# Altium schematic sheet regbot_v3.SchDoc: Regbot v.3
size A3; DrawnBy: TTAN; Engineer: TTAN; Revision: 1.2; SheetNumber: 1; SheetTotal: 1; PageSetup: Record=PageOptions|CenterHorizontal=True|CenterVertical=True|PrintScale=1.04|XCorrection=1.00|YCorrection=1.00|PrintKind=1|BorderSize=5000000|LeftOffset=0|BottomOffset=0|Orientation=2|PaperLength=1000|PaperWidth=1000|Scale=100|PaperSource=15|PrintQuality=600|MediaType=1|DitherType=10|PrintScaleMode=1|PaperKind=A3|PaperIndex=8; ProjectName: Regbot v3
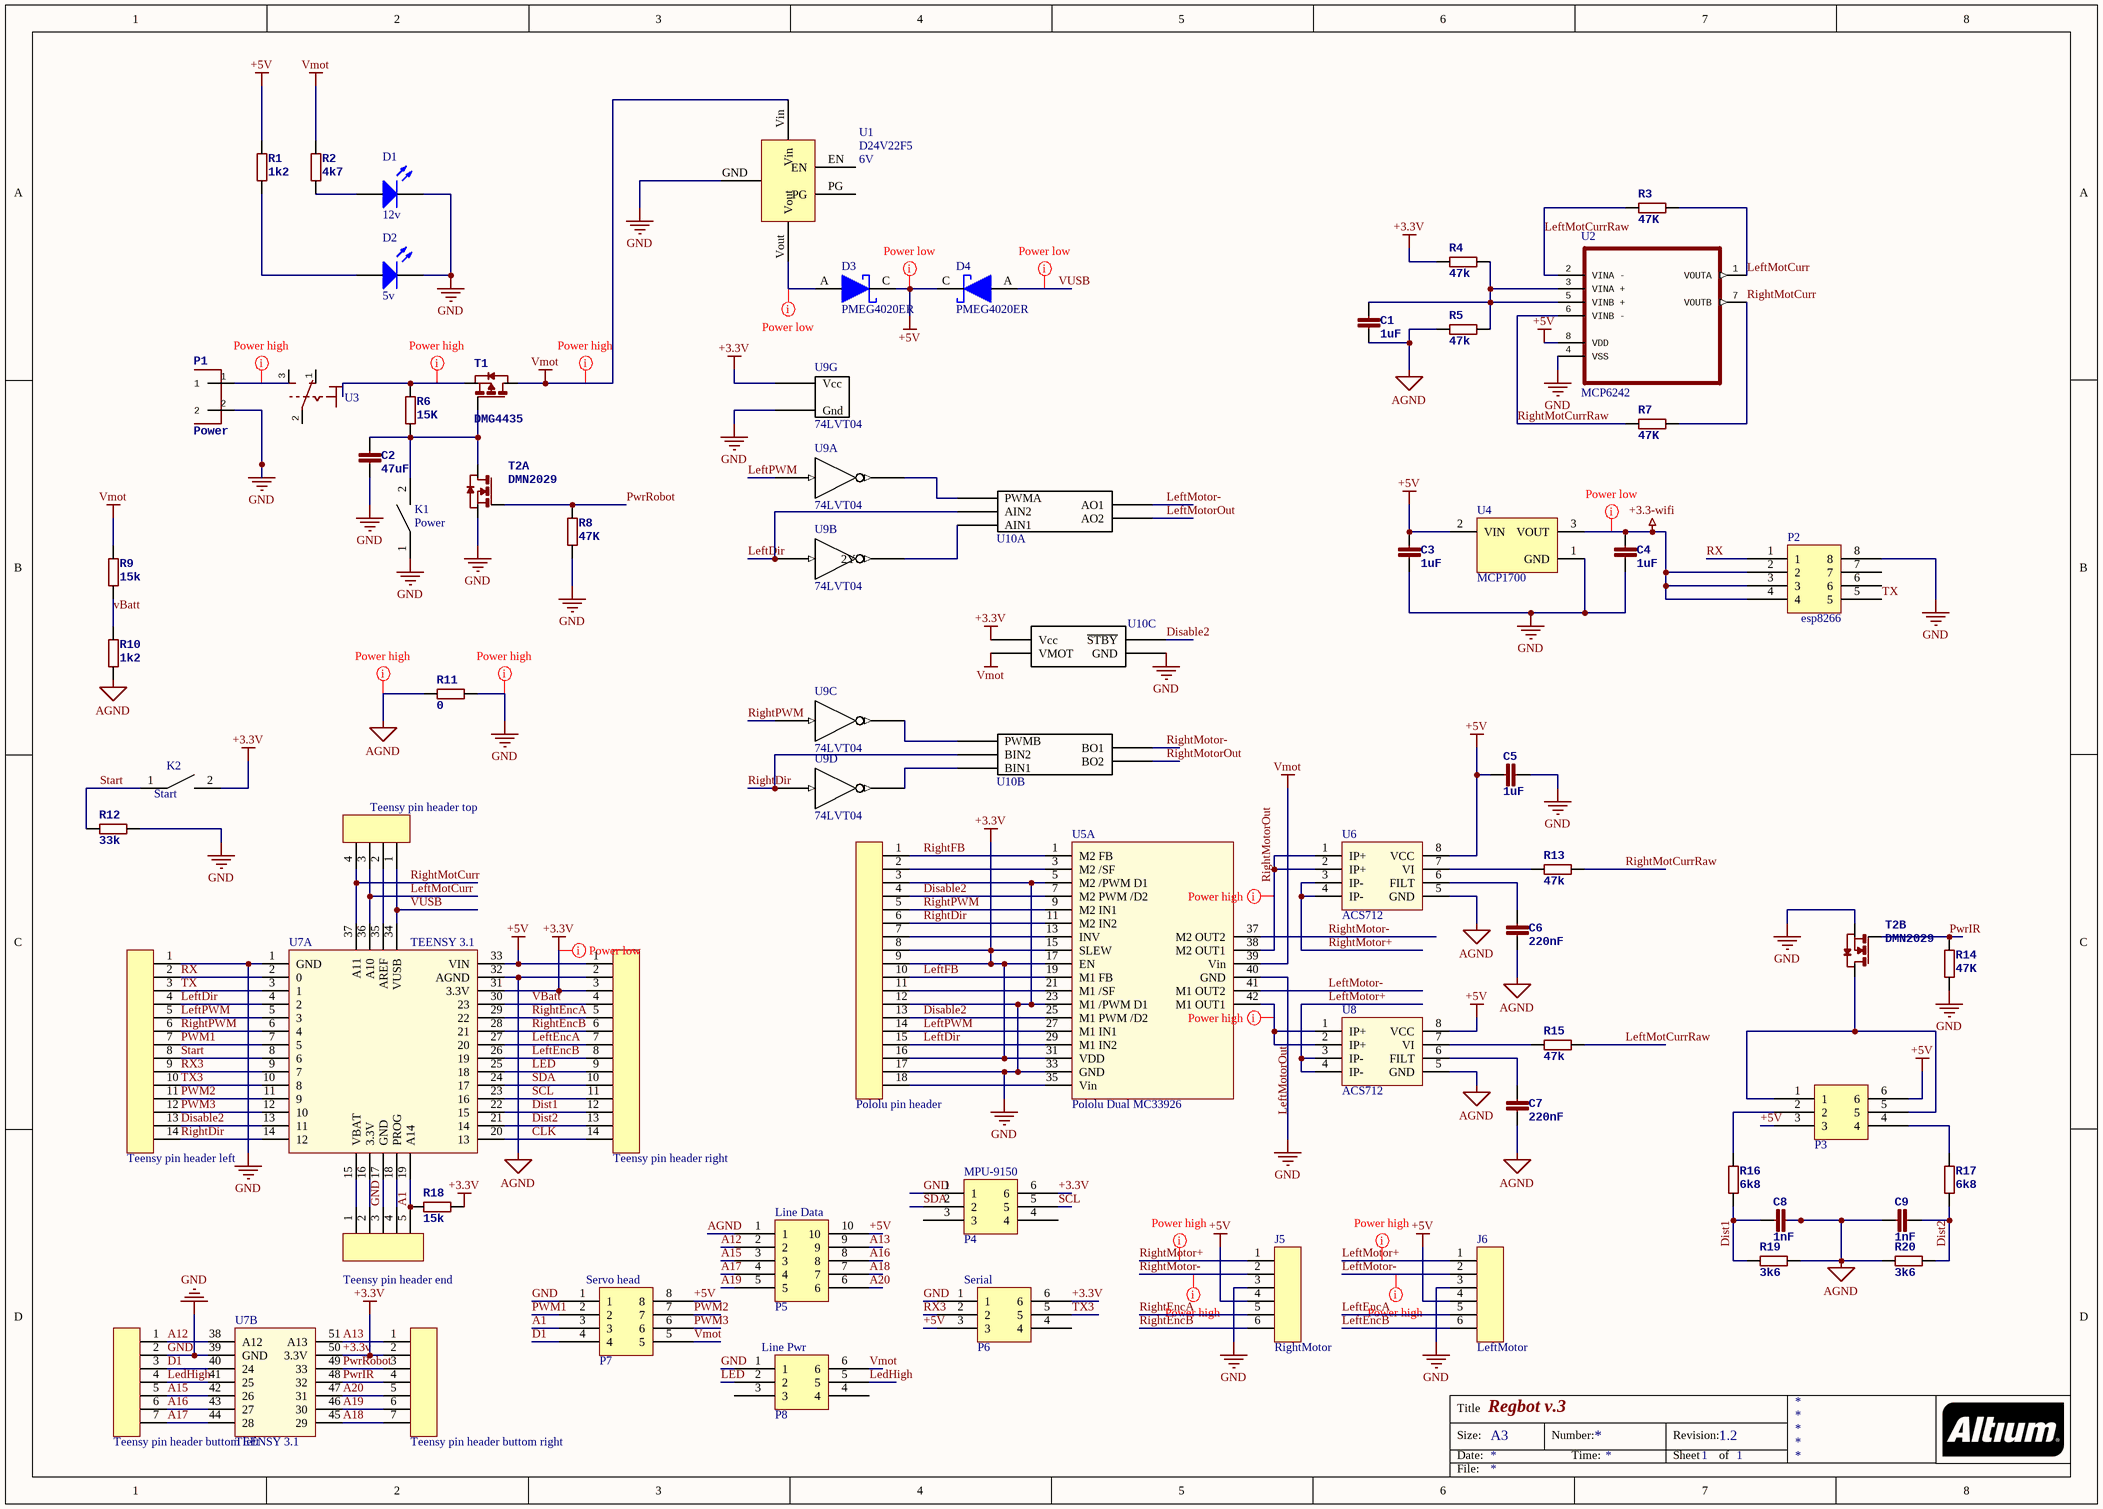
[diagram p0: regbot_v3.SchDoc]

## Parts
C1  1uF  [C1206]
C2  47uF  [C1206]
C3  1uF  [C1206]
C4  1uF  [C1206]
C5  1uF  [C1206]
C6  220nF  [C1206]
C7  220nF  [C1206]
C8  1nF  [C1206]
C9  1nF  [C1206]
D1  12v  [3.5X2.8X1.9]
D2  5v  [3.5X2.8X1.9]
D3  PMEG4020ER  [SOD123W]
D4  PMEG4020ER  [SOD123W]
J1  Teensy pin header top  [H01x04]
J2  Pololu pin header  [H01x18]
J3  Teensy pin header left  [H01x14]
J4  Teensy pin header right  [H01x14]
J5  RightMotor  [H01x06]
J6  LeftMotor  [H01x06]
J7  Teensy pin header end  [H01x05]
J8  Teensy pin header buttom left  [H01x07]
J9  Teensy pin header buttom right  [H01x07]
K1  Power  [COM_10302]
K2  Start  [COM_10302]
P1  Power  [Rising_clamp_2]
P2  esp8266  [ESP8266]
P3  IR Con  [HOUSED6]  (value not drawn)
P4  MPU-9150  [HOUSED6]
P5  Line Data  [HOUSED10]
P6  Serial  [HOUSED6]
P7  Servo head  [HOUSED8]
P8  Line Pwr  [HOUSED6]
R1  1k2  [R0805]
R2  4k7  [R0805]
R3  47K  [R0805]
R4  47k  [R0805]
R5  47k  [R0805]
R6  15K  [R0805]
R7  47K  [R0805]
R8  47K  [R0805]
R9  15k  [R0805]
R10  1k2  [R0805]
R11  0  [R0805]
R12  33k  [R0805]
R13  47k  [R0805]
R14  47K  [R0805]
R15  47k  [R0805]
R16  6k8  [R0805]
R17  6k8  [R0805]
R18  15k  [R0805]
R19  3k6  [R0805]
R20  3k6  [R0805]
T1  DMG4435  [SO8 - DMG4435]
T2  DMN2029  [SO8 - DMN2029]  (parts A,B of 2)
U1  D24V22F5  Vout: 6V  [D24V22Fx-vert]
U2  MCP6242  [SOIC127P600X175-8N]
U3  SPDS Switch  [RS-SPDS-ANGLE]  (value not drawn)
U4  MCP1700  [TO-92-TO3]
U5  Pololu Dual MC33926  [Pololu_Dual_MC33926]  (part A of 2)
U6  ACS712  [SOIC8]
U7  TEENSY 3.1  [TEENSY_3_1]  (parts A,B of 2)
U8  ACS712  [SOIC8]
U9  74LVT04  [SO14]  (parts A,B,C,D,G of 7)
U10  TB6612FNG  [Breakout16]  (value not drawn)  (parts A,B,C of 3)

## Nets
+3.3-wifi: C4.1 P2.2 P2.3 P2.4 U4.3(VOUT)
+3.3v: J2.8 J2.9 J2.16 J4.3 J9.2 K2.2 P4.6 P6.6 R4.1 R18.1 U5.15(SLEW) U5.17(EN) U5.31(VDD) U7.31(3.3V) U7.50(3.3V) U9.14(Vcc) U10.2(Vcc)
+5V: C3.1 C5.1 D3.C D4.C J4.1 J5.4 J6.4 P3.3 P3.6 P5.10 P6.3 P7.8 R1.2 U2.8(VDD) U4.2(VIN) U6.8(VCC) U7.33(VIN) U8.8(VCC)
AGND: C1.1 C6.2 C7.2 C8.2 C9.1 J4.2 P5.1 R5.1 R10.1 R11.2 R19.2 R20.1 U6.5(GND) U7.32(AGND) U8.5(GND)
GND: C2.2 C3.2 C4.2 C5.2 D1.2(K) D2.2(K) J2.3 J2.12 J2.17 J3.1 J5.3 J6.3 J7.3 J8.2 K1.1 P1.2 P2.8 P4.1 P6.1 P7.1 P8.1 R8.1 R11.1 R12.2 R14.1 T2.1(S) T2.3(S) U1.GND U2.4(VSS) U4.1(GND) U5.5(M2_/PWM_D1) U5.23(M1_/PWM_D1) U5.33(GND) U5.40(GND) U7.1(GND) U7.17(GND) U7.39(GND) U9.7(Gnd) U10.1(GND)
Vmot: P7.5 P8.6 R2.2 R9.2 T1.3(D) U1.Vin U5.39(Vin) U10.7(VMOT)
A1: J7.5 P7.3 R18.2 U7.19(A14)
A12: J8.1 P5.2 U7.38(A12)
A13: J9.1 P5.9 U7.51(A13)
A15: J8.5 P5.3 U7.42(26)
A16: J8.6 P5.8 U7.43(27)
A17: J8.7 P5.4 U7.44(28)
A18: J9.7 P5.7 U7.45(29)
A19: J9.6 P5.5 U7.46(30)
A20: J9.5 P5.6 U7.47(31)
CLK: J4.14 U7.20(13)
D1: J8.3 P7.4 U7.40(24)
Disable2: J2.4 J2.13 J3.13 U5.7(M2_PWM_/D2) U5.25(M1_PWM_/D2) U7.13(11) U10.13(~{STBY})
Dist1: C8.1 J4.12 R16.2 R19.1 U7.22(15)
Dist2: C9.2 J4.13 R17.2 R20.2 U7.21(14)
LED: J4.9 P8.2 U7.25(18)
LedHigh: J8.4 P8.5 U7.41(25)
LeftDir: J2.15 J3.4 U5.29(M1_IN2) U7.4(2) U9.3(2A) U10.15(AIN2)
LeftEncA: J4.7 J6.5 U7.27(20)
LeftEncB: J4.8 J6.6 U7.26(19)
LeftFB: J2.10 U5.19(M1_FB)
LeftMotCurr: J1.3 R3.2 U2.1(VOUTA) U7.36(A10)
LeftMotCurrRaw: R3.1 R15.2 U2.2(VINA_-)
LeftMotor+: J6.1 U8.3(IP-) U8.4(IP-)
LeftMotor-: J6.2 U5.41(M1_OUT2) U10.3(AO1)
LeftMotorOut: U5.42(M1_OUT1) U8.1(IP+) U8.2(IP+) U10.4(AO2)
LeftPWM: J2.14 J3.5 U5.27(M1_IN1) U7.5(3) U9.1(1A)
PWM1: J3.7 P7.2 U7.7(5)
PWM2: J3.11 P7.7 U7.11(9)
PWM3: J3.12 P7.6 U7.12(10)
PwrIR: J9.4 R14.2 T2.4(G) U7.48(32)
PwrRobot: J9.3 R8.2 T2.2(G) U7.49(33)
RightDir: J2.6 J3.14 U5.11(M2_IN2) U7.14(12) U9.9(4A) U10.11(BIN2)
RightEncA: J4.5 J5.5 U7.29(22)
RightEncB: J4.6 J5.6 U7.28(21)
RightFB: J2.1 U5.1(M2_FB)
RightMotCurr: J1.4 R7.2 U2.7(VOUTB) U7.37(A11)
RightMotCurrRaw: R7.1 R13.2 U2.6(VINB_-)
RightMotor+: J5.1 U6.3(IP-) U6.4(IP-)
RightMotor-: J5.2 U5.37(M2_OUT2) U10.6(BO1)
RightMotorOut: U5.38(M2_OUT1) U6.1(IP+) U6.2(IP+) U10.5(BO2)
RightPWM: J2.5 J3.6 U5.9(M2_IN1) U7.6(4) U9.5(3A)
RX: J3.2 P2.1 U7.2(0)
RX3: J3.9 P6.2 U7.9(7)
SCL: J4.11 P4.5 U7.23(16)
SDA: J4.10 P4.2 U7.24(17)
Start: J3.8 K2.1 R12.1 U7.8(6)
TX: J3.3 P2.5 U7.3(1)
TX3: J3.10 P6.5 U7.10(8)
VBatt: J4.4 R9.1 R10.2 U7.30(23)
VUSB: D4.A J1.1 U7.34(VUSB)
NetC1_2: C1.2 R4.2 R5.2 U2.3(VINA_+) U2.5(VINB_+)
NetC2_1: C2.1 K1.2 R6.1 T1.2(G) T2.7(D)
NetC6_1: C6.1 U6.6(FILT)
NetC7_1: C7.1 U8.6(FILT)
NetD1_1: D1.1(A) R2.1
NetD2_1: D2.1(A) R1.1
NetD3_A: D3.A U1.Vout
NetJ1_2: J1.2 U7.35(AREF)
NetJ2_2: J2.2 U5.3(M2_/SF)
NetJ2_7: J2.7 U5.13(INV)
NetJ2_11: J2.11 U5.21(M1_/SF)
NetJ2_18: J2.18 U5.35(Vin)
NetJ7_1: J7.1 U7.15(VBAT)
NetJ7_2: J7.2 U7.16(3.3V)
NetJ7_4: J7.4 U7.18(PROG)
NetP3_1: P3.1 P3.5 T2.5(D)
NetP3_2: P3.2 R16.1
NetP3_4: P3.4 R17.1
NetR6_2: R6.2 T1.1(S)
NetR13_1: R13.1 U6.7(VI)
NetR15_1: R15.1 U8.7(VI)
NetU9_2: U9.2(1Y) U10.16(PWMA)
NetU9_4: U9.4(2Y) U10.14(AIN1)
NetU9_6: U9.6(3Y) U10.10(PWMB)
NetU9_8: U9.8(4Y) U10.12(BIN1)

Not connected (* = marked no-connect by the designer): P1 1; P2 6 7; P4 3 4; P6 4; P8 3 4; U1 EN PG; U3 1(O) 2(P) 3(S)

## Layout directives
net class Power low: +3.3-wifi, +3.3v, +5V, NetD3_A, VUSB
net class Power high: AGND, GND, LeftMotor+, LeftMotor-, LeftMotorOut, NetP1_1, NetR6_2, RightMotor+, RightMotor-, RightMotorOut, Vmot

## Notes on the sheet
- Title
- Size:
- Date:
- A3
- Number:
- Time:
- Revision:
- Sheet
- of
- File:

## Library data of the parts
C1 C3-C5 C8 C9 = C-EU: CAPACITOR, European symbol; Tolerance: 10v
  C1 C3-C5: Value: 1uF; RS PART-NO: 434-8110
  C8 C9: Value: 1nF; RS PART-NO: 464-6824
C2 = C-EU: CAPACITOR, European symbol; Tolerance: 25v; Value: 47uF; RS PART-NO: 788-3060
C6 C7 = C-EU: CAPACITOR, European symbol; Tolerance: 50v; Value: 220nF; RS PART-NO: 698-3689
D1 D2 = LED3: Kingbright KPED-3528SURCK, 3528 Series Red LED, 630 nm 3528 (1411), Dome Lens SMD package; Published: 8-Jun-2000; LatestRevisionDate: 17-Dec-2003; LatestRevisionNote: PCB Footprint replaced.; DatasheetVersion: 16-Apr-2002; PackageVersion: 16-Apr-2002; PackageReference: 3.5X2.8X1.9; Publisher: Altium Limited; PackageDescription: SM LED; 2 C-Bend Leads; Body 3.5 x 2.8 x 1.9 mm, inc leads (LxWxH typ); RS PART-NO: 860-8964
D3 D4 = MPEG4020ER: NXP PMEG4020ER, SMT Schottky Schottky Barrier Diode, 40V 2A, 2-Pin SOD-123W; RS PART-NO: 780-5408
J1 = H01x04
J2 = H01x18
J3 J4 = H01x14
J5 J6 = H01x06: Amphenol FCI BergStik Series, Series Number 68000, 2.54mm Pitch 6 Way 1 Row Straight Header, Through Hole Termination; RS PART-NO: 863-2813
J7 = H01x05
J8 J9 = H01x07
K1 K2 = COM-10302
P1 = SCREW_CON_2X: RS Pro 5.08mm Pitch Vertical PCB Terminal Block with Clamp Termination, PCB Mount, 2 Way; RS PART-NO: 897-1238
P2 = esp8266: Amphenol T821 Series, 2.54mm Pitch 8 Way 2 Row Straight PCB Header, Solder Termination, 3A; RS PART-NO: 832-3569
P3 P4 P6 P8 = PIN_HOUSED_6: Amphenol T821 Series, 2.54mm Pitch 6 Way 2 Row Straight PCB Header, Solder Termination, 3A; RS PART-NO: 832-3496
P5 = PIN_HOUSED_10: Amphenol T821 Series, 2.54mm Pitch 10 Way 2 Row Straight PCB Header, Solder Termination, 3A; RS PART-NO: 832-3528
P7 = PIN_HOUSED_8: Amphenol T821 Series, 2.54mm Pitch 8 Way 2 Row Straight PCB Header, Solder Termination, 3A; RS PART-NO: 832-3569
R1 R2 R6 R8 R11 R12 R14 R18 = R-EU: RESISTOR, European symbol
  R1: Value: 1k2; RS PART-NO: 223-0433
  R2: Value: 4k7; RS PART-NO: 223-0528
  R6: Value: 15K; RS PART-NO: 223-0584
  R8 R14: Value: 47K; RS PART-NO: 679-1434
  R11: Value: 0; RS PART-NO: 223-0146
  R12: Value: 33k; RS PART-NO: 223-0629
  R18: Value: 15k; RS PART-NO: 223-0584
R3-R5 R7 R9 R10 R13 R15-R17 R19 R20 = R-EU: RESISTOR, European symbol; Tolerance: 1%
  R3 R7: Value: 47K; RS PART-NO: 679-1434
  R4: Value: 47k; RS PART-No: 679-1434
  R5 R13 R15: Value: 47k; RS PART-NO: 679-1434
  R9: Value: 15k; RS PART-NO: 223-0584
  R10: Value: 1k2; RS PART-NO: 223-0433
  R16 R17: Value: 6k8; RS PART-NO: 223-0540
  R19 R20: Value: 3k6; RS PART-NO: 810-1817
T1 = DMG4435SSS: Diodes Inc DMG4435SSS-13 P-channel MOSFET Transistor, 10 A, 30 V, 8-Pin SOIC; RS PART-NO: 823-3205
T2 = DMN2029: Diodes Inc DMN2029USD-13 Dual N-channel MOSFET Transistor, 6.9 A, 20 V, 8-Pin SOIC; RS PART-NO: 827-0471
U1 = D24V22Fx: Pololu xV, 2.5A Step-Down Voltage Regulator; URL: https://www.pololu.com/product/2859
U2 = MCP6242: Microchip MCP6242-E/SN, Dual Op Amp, 550kHz CMOS, Rail to Rail, 3 V, 5 V, 8-Pin SOIC; RS PART-NO: 403-226
U3 = SPDS-ANGLE: Toggle Switch SPDT On-On, 5 A, PCB; RS PART-NO: 734-7107
U4 = MCP1700-3302E/TO: Low Quiescent Current LDO, 3-Pin TO-92, Extended TemperatureBAG; Published: 29-Jan-2009; DatasheetVersion: revB, Feb-2007; PackageVersion: revBB, Aug-2009; PackageReference: TO-92-TO3; Publisher: Altium Limited; PackageDescription: 3-Lead Plastic Transistor Outline (TO) [TO-92]; Supplier 1: Digi-Key; Supplier Part Number 1: MCP1700-3302E/TO-ND; Supplier 2: Farnell; Supplier Part Number 2: 1296588; ComponentLink1Description: Datasheet; ComponentLink1URL: http://ww1.microchip.com/downloads/en/DeviceDoc/21826b.pdf; ComponentLink2Description: Packaging Specification; ComponentLink2URL: http://www.microchip.com/stellent/groups/techpub_sg/documents/packagingspec/en012702.pdf; ComponentLink3Description: Microchip.com Home; ComponentLink3URL: http://www.microchip.com/; Supplier 3: RS Component; Supplier Part Number 3: 403-888; RS PART-NO: 403-888
U6 U8 = ACS712ELCTR-05B-T: RS PART-NO: 680-7131
U9 = 74LVT04: Hex inverter; RS PART-NO: 816-8867
U10 = TB6612FNG_pololu: Polulu #713 carrier board